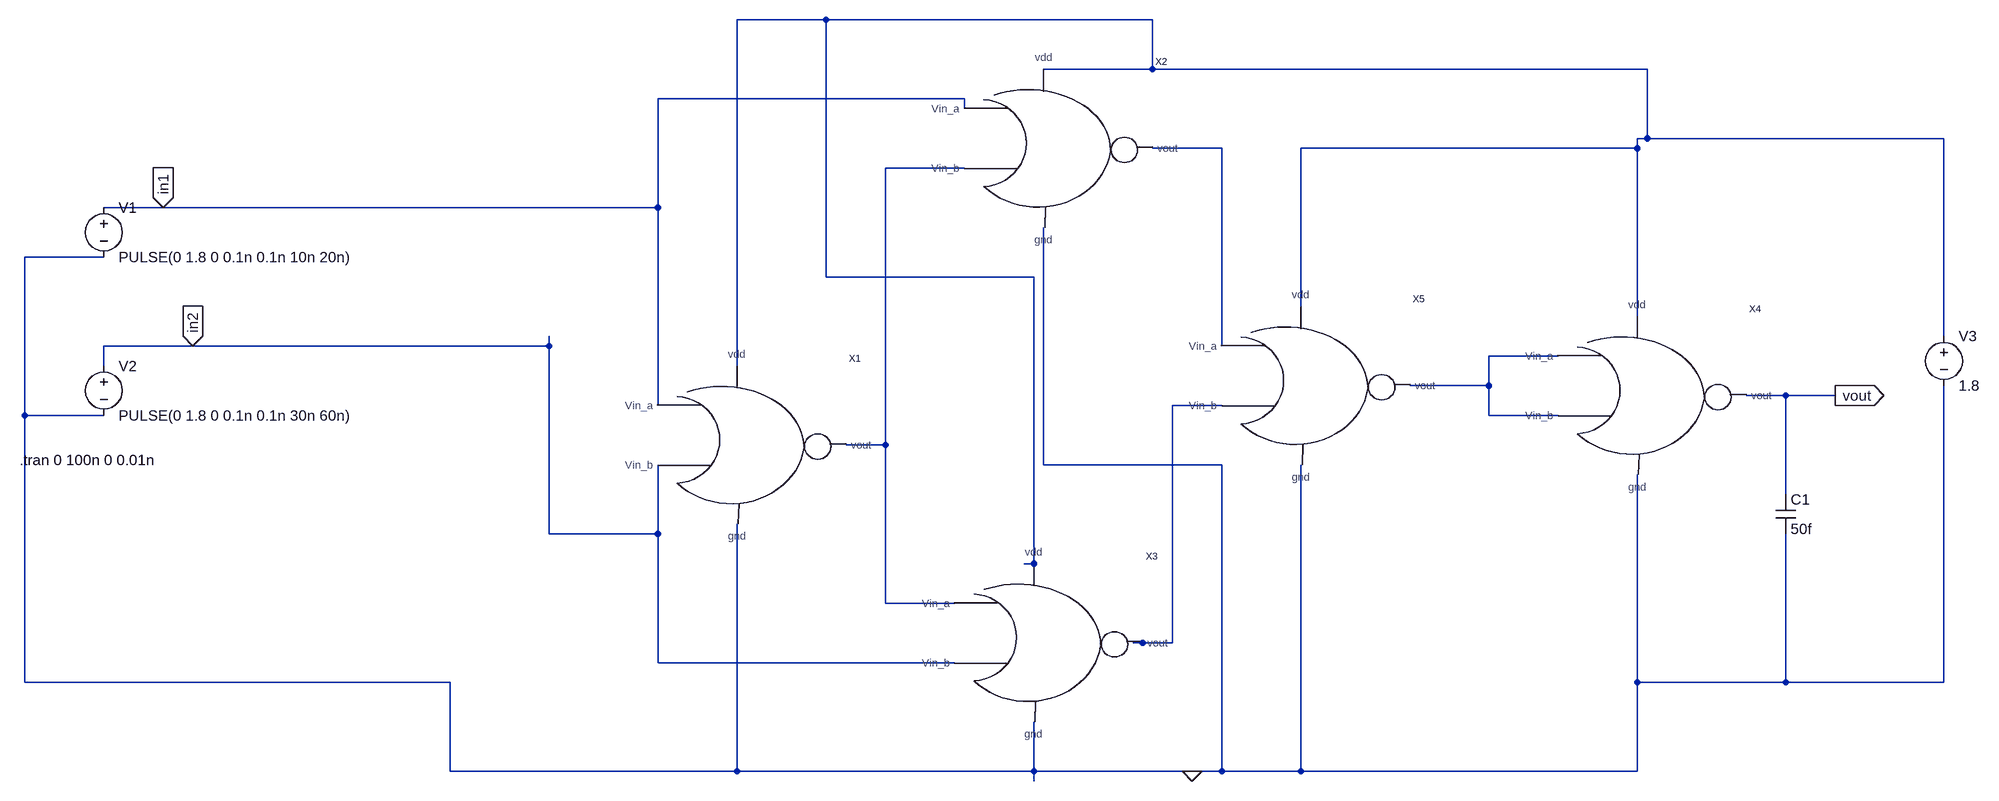
[diagram p0: schematic xor_using_nor_cos.asc]
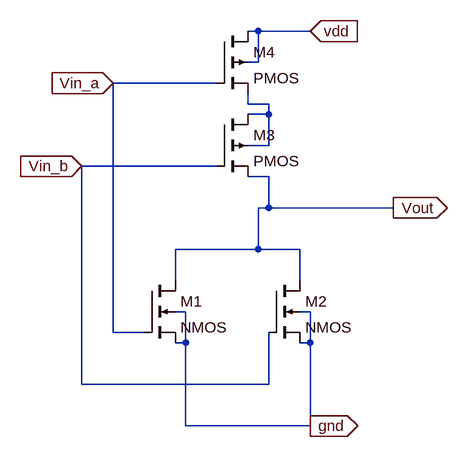
[diagram p1: sub-circuit nor_cos.asc]
xor_using_nor_cos.asc, the LTspice schematic file:
Version 4.1
SHEET 1 1724 868
WIRE -176 -384 -320 -384
WIRE 352 -384 -176 -384
WIRE 352 -304 352 -384
WIRE 352 -304 176 -304
WIRE 1152 -304 352 -304
WIRE 48 -256 -448 -256
WIRE 48 -240 48 -256
WIRE 1152 -192 1152 -304
WIRE 1152 -192 1136 -192
WIRE 1632 -192 1152 -192
WIRE 464 -176 352 -176
WIRE 1136 -176 1136 -192
WIRE 1136 -176 592 -176
WIRE 48 -144 -80 -144
WIRE -1248 -80 -1344 -80
WIRE -448 -80 -448 -256
WIRE -448 -80 -1248 -80
WIRE -1344 0 -1472 0
WIRE -176 32 -176 -384
WIRE 160 32 -176 32
WIRE 592 80 592 -176
WIRE 1136 96 1136 -176
WIRE 1632 128 1632 -192
WIRE -1200 144 -1344 144
WIRE -624 144 -624 128
WIRE -624 144 -1200 144
WIRE 464 144 464 -176
WIRE 1008 160 896 160
WIRE -1344 176 -1344 144
WIRE -320 176 -320 -384
WIRE 896 208 896 160
WIRE 896 208 768 208
WIRE 1376 224 1312 224
WIRE 1456 224 1376 224
WIRE -448 240 -448 -80
WIRE 464 240 384 240
WIRE -1472 256 -1472 0
WIRE -1344 256 -1472 256
WIRE 896 256 896 208
WIRE 1008 256 896 256
WIRE -80 304 -80 -144
WIRE -80 304 -144 304
WIRE 176 336 176 -48
WIRE 464 336 176 336
WIRE 1376 384 1376 224
WIRE -624 448 -624 144
WIRE -448 448 -448 336
WIRE -448 448 -624 448
WIRE 160 496 160 32
WIRE 160 496 144 496
WIRE -80 560 -80 304
WIRE 32 560 -80 560
WIRE 336 624 320 624
WIRE 384 624 384 240
WIRE 384 624 336 624
WIRE -448 656 -448 448
WIRE 32 656 -448 656
WIRE -1472 688 -1472 256
WIRE -784 688 -1472 688
WIRE 1136 688 1136 352
WIRE 1376 688 1376 448
WIRE 1376 688 1136 688
WIRE 1632 688 1632 208
WIRE 1632 688 1376 688
WIRE -784 832 -784 688
WIRE -320 832 -320 432
WIRE -320 832 -784 832
WIRE 160 832 160 752
WIRE 160 832 -320 832
WIRE 416 832 160 832
WIRE 464 832 464 336
WIRE 464 832 416 832
WIRE 592 832 592 336
WIRE 592 832 464 832
WIRE 1136 832 1136 688
WIRE 1136 832 592 832
WIRE 160 848 160 832
FLAG -1248 -80 in1
IOPIN -1248 -80 In
FLAG -1200 144 in2
IOPIN -1200 144 In
FLAG 1456 224 vout
IOPIN 1456 224 Out
FLAG 416 832 0
SYMBOL nor_cos 1040 192 R0
SYMATTR InstName X4
SYMBOL voltage -1344 -96 R0
WINDOW 123 0 0 Left 0
WINDOW 39 0 0 Left 0
SYMATTR InstName V1
SYMATTR Value PULSE(0 1.8 0 0.1n 0.1n 10n 20n)
SYMBOL voltage -1344 160 R0
WINDOW 123 0 0 Left 0
WINDOW 39 0 0 Left 0
SYMATTR InstName V2
SYMATTR Value PULSE(0 1.8 0 0.1n 0.1n 30n 60n)
SYMBOL cap 1360 384 R0
SYMATTR InstName C1
SYMATTR Value 50f
SYMBOL voltage 1632 112 R0
WINDOW 123 0 0 Left 0
WINDOW 39 0 0 Left 0
SYMATTR InstName V3
SYMATTR Value 1.8
SYMBOL nor_cos -416 272 R0
SYMATTR InstName X1
SYMBOL nor_cos 80 -208 R0
SYMATTR InstName X2
SYMBOL nor_cos 64 592 R0
SYMATTR InstName X3
SYMBOL nor_cos 496 176 R0
SYMATTR InstName X5
TEXT -1480 328 Left 2 !.tran 0 100n 0 0.01n

nor_cos.asc, the sub-circuit schematic file:
Version 4
SHEET 1 880 680
WIRE 368 -208 352 -208
WIRE 448 -208 368 -208
WIRE 368 -160 368 -208
WIRE 368 -160 352 -160
WIRE 304 -128 144 -128
WIRE 352 -96 352 -112
WIRE 384 -96 352 -96
WIRE 384 -80 384 -96
WIRE 384 -80 352 -80
WIRE 384 -32 384 -80
WIRE 384 -32 352 -32
WIRE 304 0 96 0
WIRE 384 16 352 16
WIRE 384 64 384 16
WIRE 384 64 368 64
WIRE 576 64 384 64
WIRE 368 128 368 64
WIRE 368 128 240 128
WIRE 432 128 368 128
WIRE 240 176 240 128
WIRE 432 176 432 128
WIRE 256 224 240 224
WIRE 448 224 432 224
WIRE 144 256 144 -128
WIRE 192 256 144 256
WIRE 256 272 256 224
WIRE 256 272 240 272
WIRE 448 272 448 224
WIRE 448 272 432 272
WIRE 96 336 96 0
WIRE 384 336 384 256
WIRE 384 336 96 336
WIRE 256 400 256 272
WIRE 448 400 448 272
WIRE 448 400 256 400
FLAG 144 -128 Vin_a
IOPIN 144 -128 In
FLAG 96 0 Vin_b
IOPIN 96 0 In
FLAG 448 400 gnd
IOPIN 448 400 Out
FLAG 448 -208 vdd
IOPIN 448 -208 In
FLAG 576 64 Vout
IOPIN 576 64 Out
SYMBOL nmos4 192 176 R0
SYMATTR InstName M1
SYMATTR Value2 l=180nm w=270nm
SYMBOL nmos4 384 176 R0
SYMATTR InstName M2
SYMATTR Value2 l=180nm w=270nm
SYMBOL pmos4 304 -208 R0
SYMATTR InstName M4
SYMATTR Value2 l=180nm w=810nm
SYMBOL pmos4 304 -80 R0
SYMATTR InstName M3
SYMATTR Value2 l=180nm w=810nm

The netlist it stands for:
* xor_using_nor_cos.asc
X§X4 N004 N004 N001 0 vout nor_cos
V1 in1 0 PULSE(0 1.8 0 0.1n 0.1n 10n 20n)
V2 in2 0 PULSE(0 1.8 0 0.1n 0.1n 30n 60n)
C1 vout 0 50f
V3 N001 0 1.8
X§X1 in1 in2 N001 0 N003 nor_cos
X§X2 in1 N003 N001 0 N002 nor_cos
X§X3 N003 in2 N001 0 N005 nor_cos
X§X5 N002 N005 N001 0 N004 nor_cos

* block symbol definitions
.subckt nor_cos Vin_a Vin_b vdd gnd vout
M1 Vout Vin_a gnd gnd NMOS l=180nm w=270nm
M2 Vout Vin_b gnd gnd NMOS l=180nm w=270nm
M4 vdd Vin_a N001 vdd PMOS l=180nm w=810nm
M3 N001 Vin_b Vout N001 PMOS l=180nm w=810nm
.ends nor_cos

.model NMOS NMOS
.model PMOS PMOS
.lib standard.mos
.tran 0 100n 0 0.01n
.backanno
.end